# EAGLE design BASEBOARD-1-V.1.0 (EAGLE 5.06)

## Sheet 1 of 2
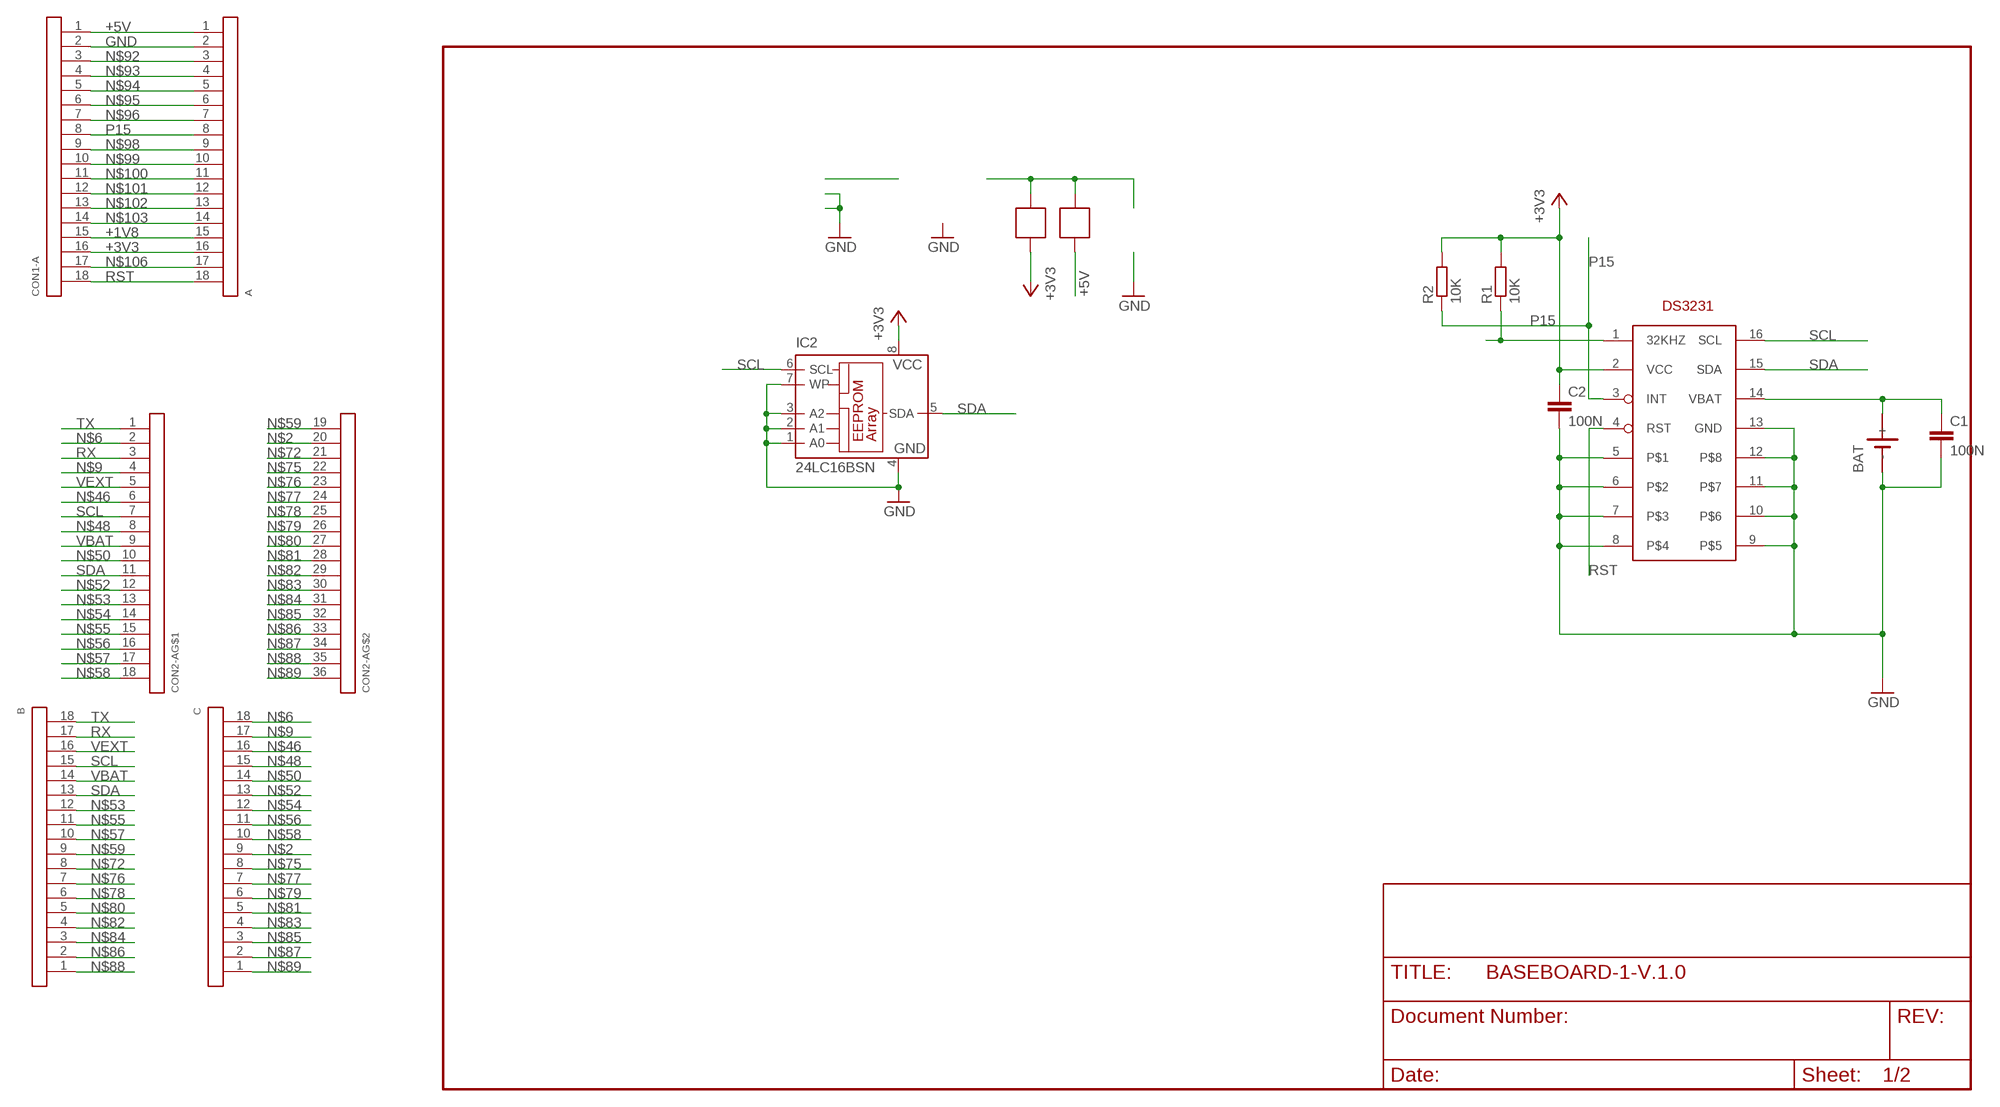
[diagram p0: schematic, sheet 1]

### Parts
A  CON18ARMCON  [CON-ARMED-18-1]
B  CON18ARMCON  [CON-ARMED-18-1]
BAT  SN2032  [SN2032]
C  CON18ARMCON  [CON-ARMED-18-1]
C1  100N  C-EUC0805  [C0805]
C2  100N  C-EUC0805  [C0805]
CON1-A  CON18ARMCON  [CON-ARMED-18-1]
CON2-A  CON18-2  [CON-ARMED-18-2]
IC2  24LC16BSN  [SO-08]
IC4  DS3231  [SO16]
R1  10K  R-EU_M0805  [M0805]
R2  10K  R-EU_M0805  [M0805]
U$1  SOLDERJUMPER  [SOLDERJUMP1]
U$2  SOLDERJUMPER  [SOLDERJUMP1]

### Nets
32KHZ: IC4.1(32KHZ) R1.1
+1V8: A.15 CON1-A.15
+3V3: A.16 C2.1 CON1-A.16 IC2.8(VCC) IC4.2(VCC) R1.2 R2.2 U$1.1 ; also sheet 2
+5V: A.1 CON1-A.1 U$2.1
GND: A.2 BAT.- C1.2 C2.2 CON1-A.2 IC2.1(A0) IC2.2(A1) IC2.3(A2) IC2.4(GND) IC2.7(WP) IC4.5 IC4.6 IC4.7 IC4.8 IC4.9 IC4.10 IC4.11 IC4.12 IC4.13(GND) ; also sheet 2
N$2: C.9 CON2-A.20
N$3: U$1.2 U$2.2
N$6: C.18 CON2-A.2
N$9: C.17 CON2-A.4
N$46: C.16 CON2-A.6
N$48: C.15 CON2-A.8
N$50: C.14 CON2-A.10
N$52: C.13 CON2-A.12
N$53: B.12 CON2-A.13
N$54: C.12 CON2-A.14
N$55: B.11 CON2-A.15
N$56: C.11 CON2-A.16
N$57: B.10 CON2-A.17
N$58: C.10 CON2-A.18
N$59: B.9 CON2-A.19
N$72: B.8 CON2-A.21
N$75: C.8 CON2-A.22
N$76: B.7 CON2-A.23
N$77: C.7 CON2-A.24
N$78: B.6 CON2-A.25
N$79: C.6 CON2-A.26
N$80: B.5 CON2-A.27
N$81: C.5 CON2-A.28
N$82: B.4 CON2-A.29
N$83: C.4 CON2-A.30
N$84: B.3 CON2-A.31
N$85: C.3 CON2-A.32
N$86: B.2 CON2-A.33
N$87: C.2 CON2-A.34
N$88: B.1 CON2-A.35
N$89: C.1 CON2-A.36
N$92: A.3 CON1-A.3
N$93: A.4 CON1-A.4
N$94: A.5 CON1-A.5
N$95: A.6 CON1-A.6
N$96: A.7 CON1-A.7
N$98: A.9 CON1-A.9
N$99: A.10 CON1-A.10
N$100: A.11 CON1-A.11
N$101: A.12 CON1-A.12
N$102: A.13 CON1-A.13
N$103: A.14 CON1-A.14
N$106: A.17 CON1-A.17
P15: A.8 CON1-A.8 IC4.3(INT) R2.1
RST: A.18 CON1-A.18 IC4.4(RST)
RX: B.17 CON2-A.3 ; also sheet 2
SCL: B.15 CON2-A.7 IC2.6(SCL) IC4.16(SCL)
SDA: B.13 CON2-A.11 IC2.5(SDA) IC4.15(SDA)
TX: B.18 CON2-A.1 ; also sheet 2
VBAT: B.14 BAT.+ C1.1 CON2-A.9 IC4.14(VBAT)
VEXT: B.16 CON2-A.5

## Sheet 2 of 2
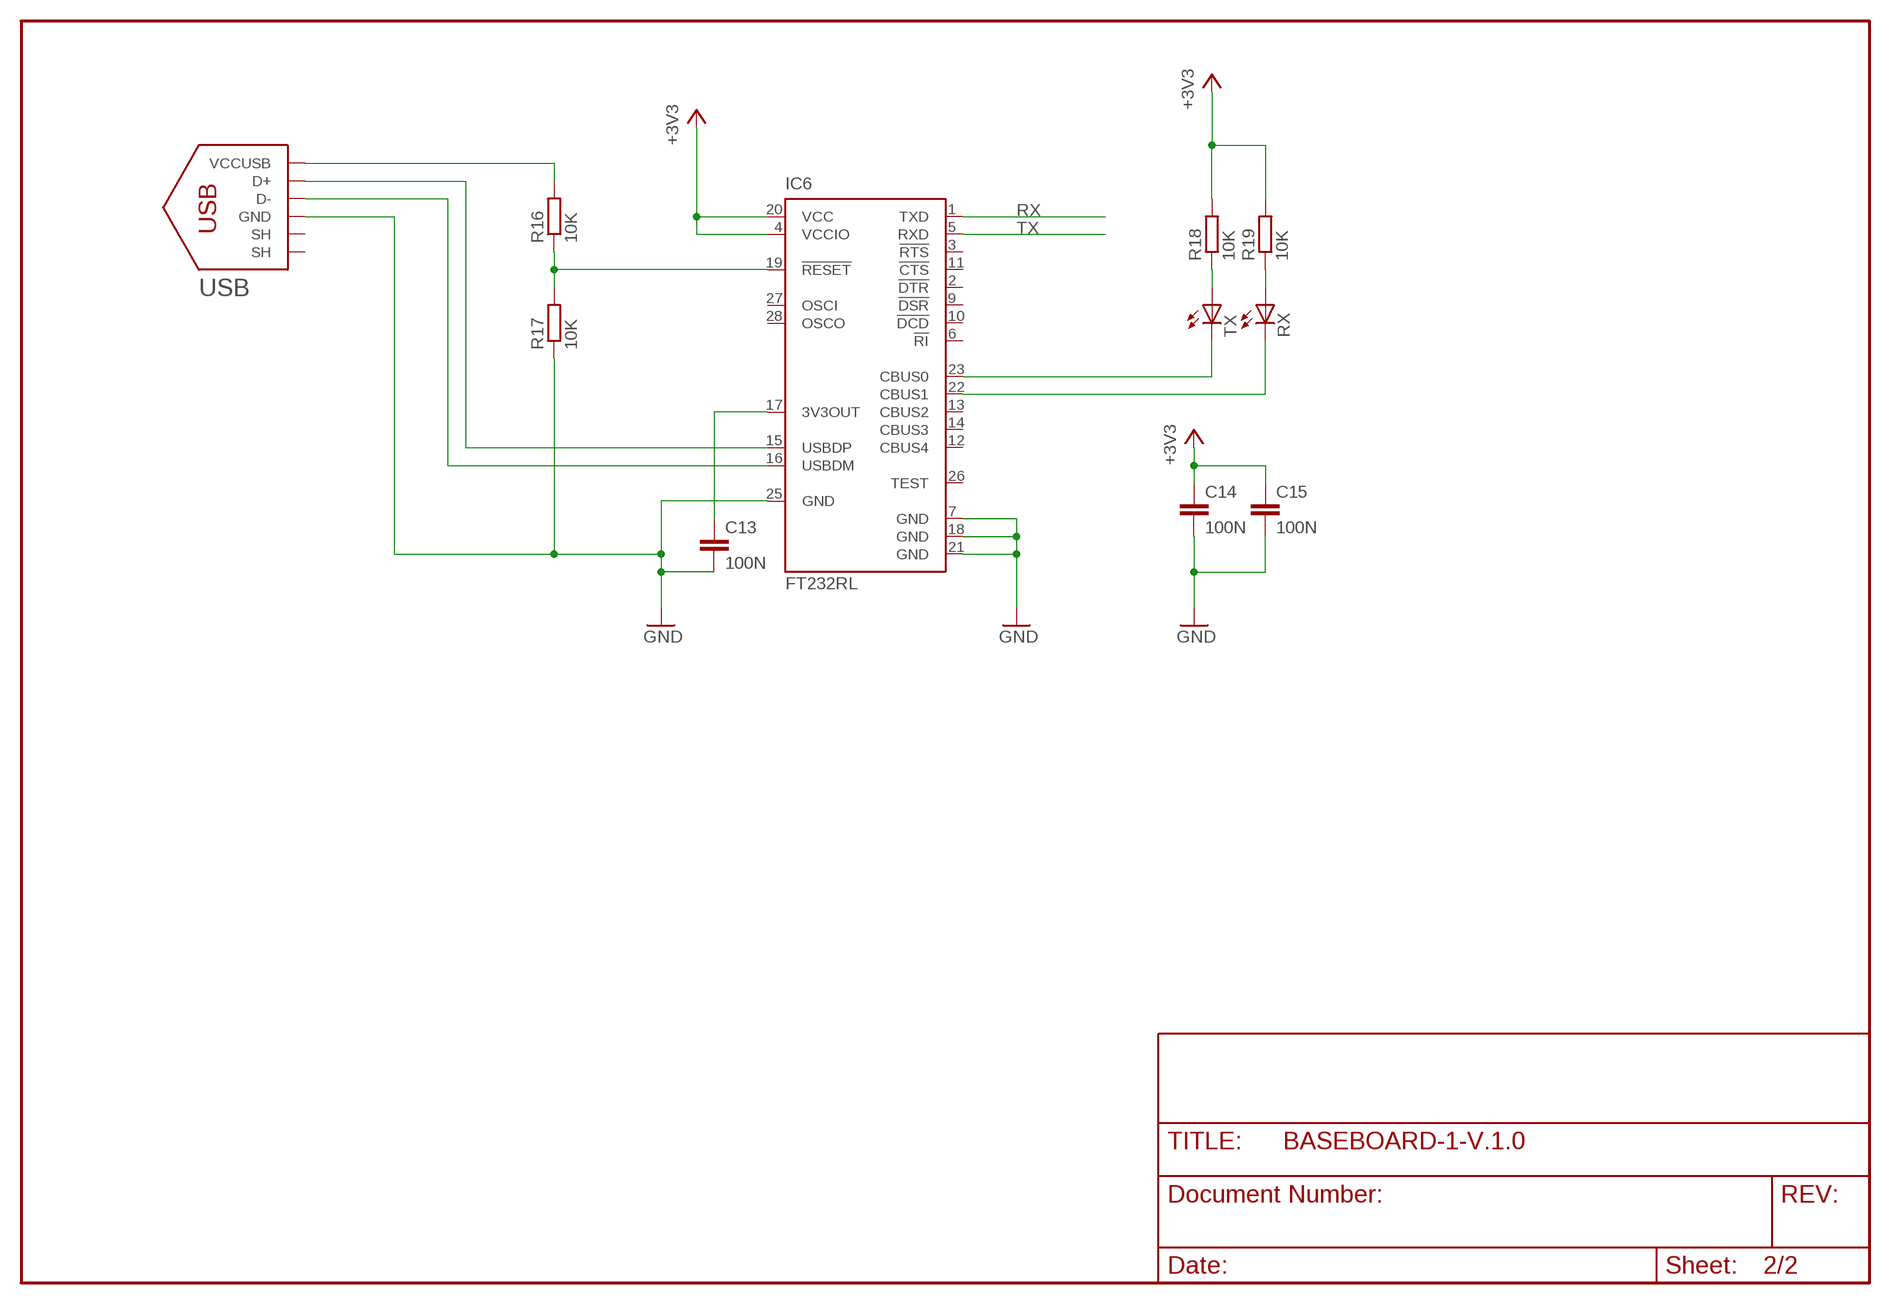
[diagram p1: schematic, sheet 2]

### Parts
C13  100N  C-EUC0805  [C0805]
C14  100N  C-EUC0805  [C0805]
C15  100N  C-EUC0805  [C0805]
IC6  FT232RL  [SSOP28]
R16  10K  R-EU_M0805  [M0805]
R17  10K  R-EU_M0805  [M0805]
R18  10K  R-EU_M0805  [M0805]
R19  10K  R-EU_M0805  [M0805]
RX  LEDCHIPLED_0805  [CHIPLED_0805]
TX  LEDCHIPLED_0805  [CHIPLED_0805]
USB  USBCONNMINI-B-HOLE  [USB-MB-H]

### Nets
+3V3: C14.1 C15.1 IC6.4(VCCIO) IC6.20(VCC) R18.2 R19.2 ; also sheet 1
GND: C13.2 C14.2 C15.2 IC6.7(GND) IC6.18(GND) IC6.21(GND) IC6.25(GND) R17.1 USB.GND ; also sheet 1
N$123: IC6.19(!RESET) R16.1 R17.2
N$124: R16.2 USB.VBUS(VCCUSB)
N$125: IC6.15(USBDP) USB.D+
N$126: IC6.16(USBDM) USB.D-
N$127: C13.1 IC6.17(3V3OUT)
N$129: IC6.23(CBUS0) TX.C
N$130: IC6.22(CBUS1) RX.C
N$132: R18.1 TX.A
N$133: R19.1 RX.A
RX: IC6.1(TXD) ; also sheet 1
TX: IC6.5(RXD) ; also sheet 1
Unconnected: IC6.2(!DTR) IC6.3(!RTS) IC6.6(!RI) IC6.9(!DSR) IC6.10(!DCD) IC6.11(!CTS) IC6.12(CBUS4) IC6.13(CBUS2) IC6.14(CBUS3) IC6.26(TEST) IC6.27(OSCI) IC6.28(OSCO) USB.GND@1(SH) USB.GND@2(SH)

## Library data of the parts
A B C CON1-A = turbod3:CON18
BAT = turbod3:SN2032: LI BATTERY
C1 C2 C13-C15 = turbod3:C-EU: CAPACITOR, European symbol
CON2-A = turbod3:CON18-2
IC2 = microchip-5:24*: Serial EEPROM I2C
IC4 = DS3231:DS3231
IC6 = ftdichip:FT232R: Source: http://www.ftdichip.com/Documents/DataSheets/DS_FT232R_v104.pdf
R1 R2 R16-R19 = turbod3:R-EU_: RESISTOR, European symbol
RX TX = turbod3:LED: LED OSRAM: - CHIPLED LG R971, LG N971, LY N971, LG Q971, LY Q971, LO R971, LY R971 LH N974, LH R974 LS Q976, LO Q976, LY Q976 LO Q996 - Hyper CHIPLED LW Q18S LB Q993, LB Q99A, LB R99A - SideLED LS A670, LO A670, LY A670, LG A670, LP A670 LB A673, LV A673, LT A673, LW A673 LH A674 LY A675 LS A676, LA A676, LO A676, LY A676, LW A676 LS A679, LY A679, LG A679 - Hyper Micro SIDELED® LS Y876, LA Y876, LO Y876, LY Y876 LT Y87S - SmartLED LW L88C, LW L88S LB L89C, LB L89S, LG L890 LS L89K, LO L89K, LY L89K LS L896, LA L896, LO L896, LY L896 - TOPLED LS T670, LO T670, LY T670, LG T670, LP T670 LSG T670, LSP T670, LSY T670, LOP T670, LYG T670 LG T671, LOG T671, LSG T671 LB T673, LV T673, LT T673, LW T673 LH T674 LS T676, LA T676, LO T676, LY T676, LB T676, LH T676, LSB T676, LW T676 LB T67C, LV T67C, LT T67C, LS T67K, LO T67K, LY T67K, LW E67C LS E67B, LA E67B, LO E67B, LY E67B, LB E67C, LV E67C, LT E67C LW T67C LS T679, LY T679, LG T679 LS T770, LO T770, LY T770, LG T770, LP T770 LB T773, LV T773, LT T773, LW T773 LH T774 LS E675, LA E675, LY E675, LS T675 LS T776, LA T776, LO T776, LY T776, LB T776 LHGB T686 LT T68C, LB T68C - Hyper Mini TOPLED® LB M676 - Mini TOPLED Santana® LG M470 LS M47K, LO M47K, LY M47K Source: http://www.osram.convergy.de LUXEON: - LUMILED® LXK2-PW12-R00, LXK2-PW12-S00, LXK2-PW14-U00, LXK2-PW14-V00 LXK2-PM12-R00, LXK2-PM12-S00, LXK2-PM14-U00 LXK2-PE12-Q00, LXK2-PE12-R00, LXK2-PE12-S00, LXK2-PE14-T00, LXK2-PE14-U00 LXK2-PB12-K00, LXK2-PB12-L00, LXK2-PB12-M00, LXK2-PB14-N00, LXK2-PB14-P00, LXK2-PB14-Q00 LXK2-PR12-L00, LXK2-PR12-M00, LXK2-PR14-Q00, LXK2-PR14-R00 LXK2-PD12-Q00, LXK2-PD12-R00, LXK2-PD12-S00 LXK2-PH12-R00, LXK2-PH12-S00 LXK2-PL12-P00, LXK2-PL12-Q00, LXK2-PL12-R00 Source: www.luxeon.com KINGBRIGHT: KA-3528ASYC Source: www.kingbright.com
U$1 U$2 = turbod3:SOLDERJUMPER
USB = turbod3:USBCONN

## Board
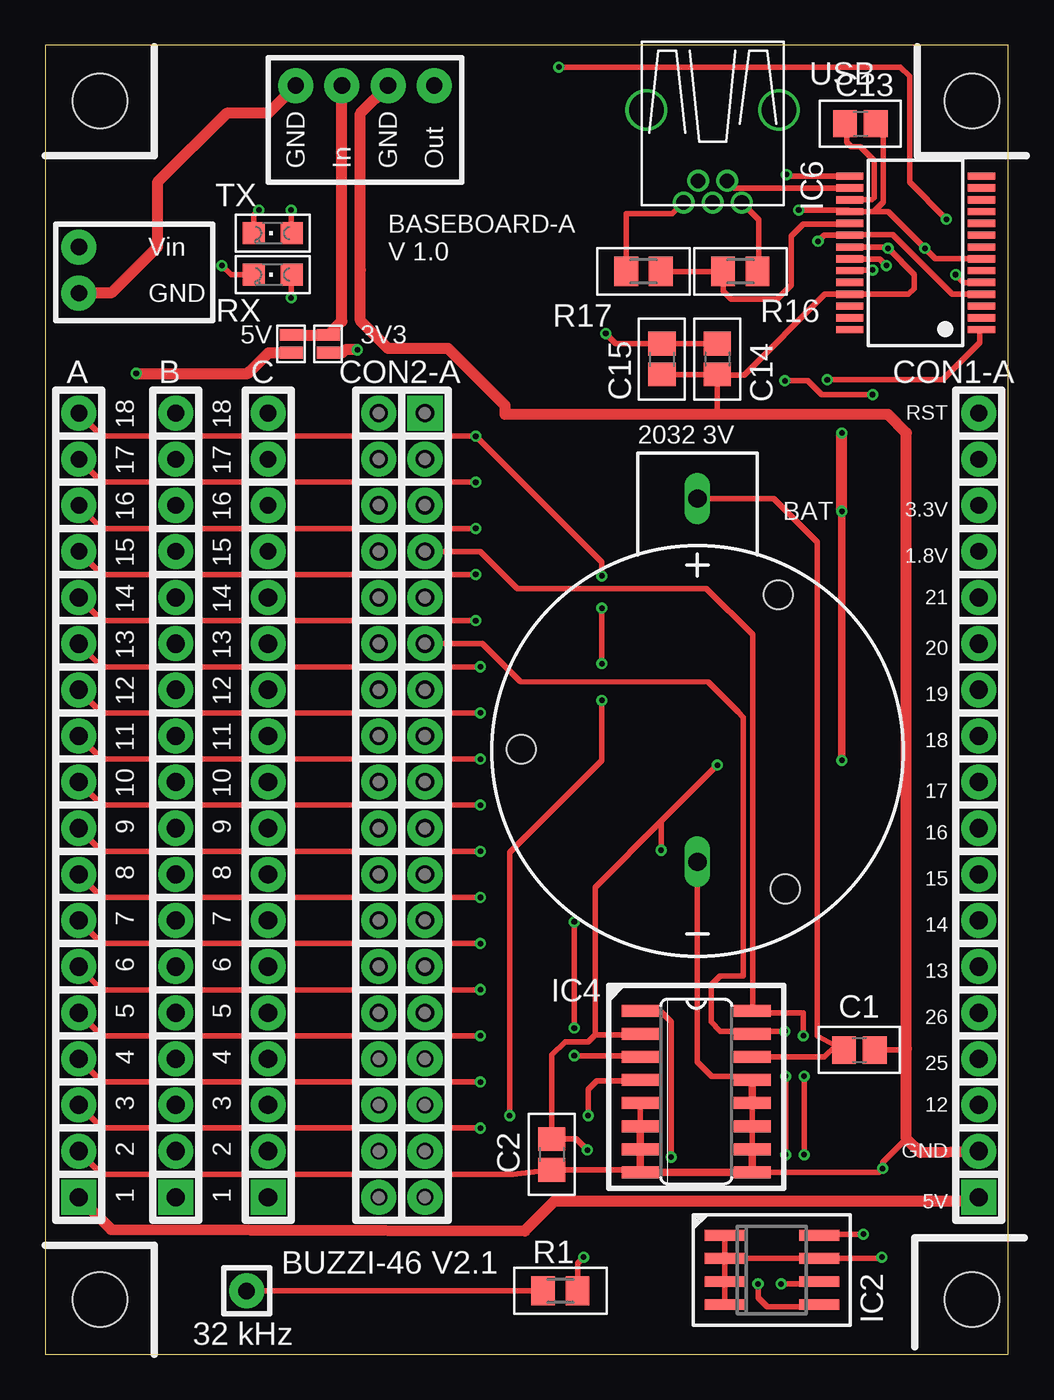
[diagram p2: board, top side]
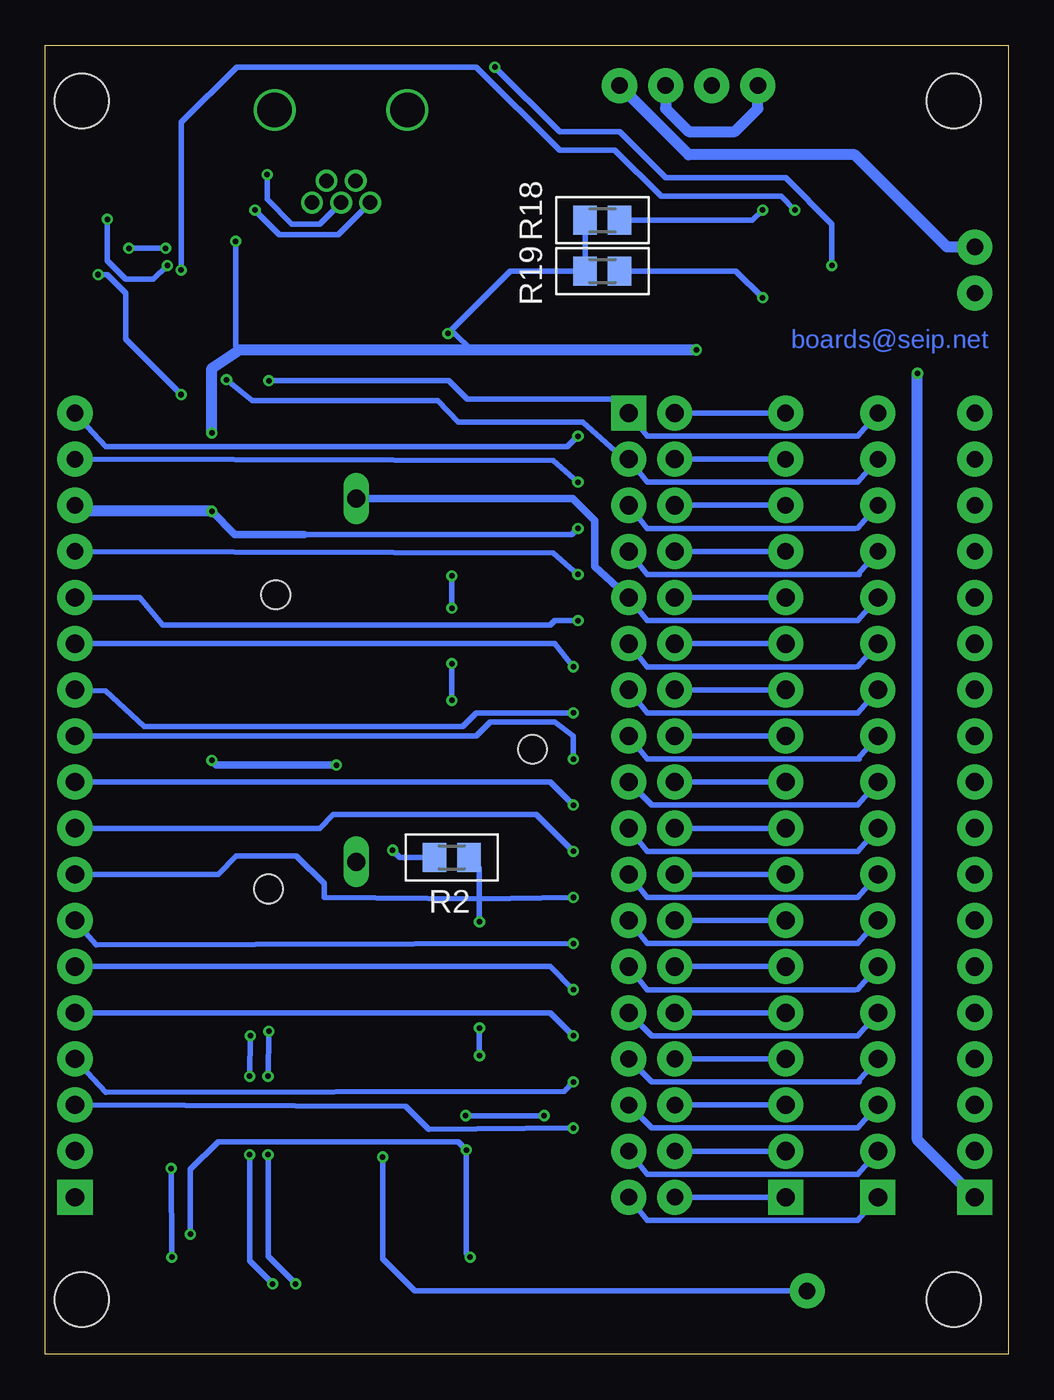
[diagram p3: board, bottom side, seen from below]

Size 53 x 72.06 mm. Coordinates in mm from the lower left corner, seen from the top.
Outline: 0,72.06 0,0 53,0 53,72.06 0,72.06
Copper layers (1*16): Top 0.035mm / dielectric 1.5mm / Bottom 0.035mm
Design rules "PCB-POOL": minimum track width 6mil, minimum drill 12mil, track to track 6mil, track to pad 6mil, pad to pad 6mil, via to via 6mil, smd to smd 6mil, copper to edge 20mil, drill to drill 8mil, minimum pad ring 8mil, minimum via ring 6mil, stop-mask expansion 3mil, vias tented up to drill 0mil, thermal gap 8mil
Holes 3 mm at 51,69 51,3 3,3 3,69

### Footprints (pad centres in the part's own frame; a part is rotated, then mirrored left to right if it is on the bottom)
CON-ARMED-18-1 = drill 1 pad 1.93 square: 1 -21.59,0 | drill 1 pad 1.93 round: 2 -19.05,0; 3 -16.51,0; 4 -13.97,0; 5 -11.43,0; 6 -8.89,0; 7 -6.35,0; 8 -3.81,0; 9 -1.27,0; 10 1.27,0; 11 3.81,0; 12 6.35,0; 13 8.89,0; 14 11.43,0 | drill 0.914 pad 1.93 round: 15 13.97,0; 16 16.51,0; 17 19.05,0; 18 21.59,0
SN2032 = drill 1 long: + 0,13.9; - 0,-6.1 | hole 1.6: 4.44,8.6; -9.7,0.1; 4.83,-7.6
C0805 = smd 1.3 x 1.5: 1 -0.85,0; 2 0.85,0
CON-ARMED-18-2 = drill 1 pad 1.93 square: 1 -21.59,1.27 | drill 1 pad 1.93 round: 2 -21.59,-1.27; 3 -19.05,1.27; 4 -19.05,-1.27; 5 -16.51,1.27; 6 -16.51,-1.27; 7 -13.97,1.27; 8 -13.97,-1.27; 9 -11.43,1.27; 10 -11.43,-1.27; 11 -8.89,1.27; 12 -8.89,-1.27; 13 -6.35,1.27; 14 -6.35,-1.27; 15 -3.81,1.27; 16 -3.81,-1.27; 17 -1.27,1.27; 18 -1.27,-1.27; 19 1.27,1.27; 20 1.27,-1.27; 21 3.81,1.27; 22 3.81,-1.27; 23 6.35,1.27; 24 6.35,-1.27; 25 8.89,1.27; 26 8.89,-1.27; 27 11.43,1.27; 28 11.43,-1.27 | drill 0.914 pad 1.93 round: 29 13.97,1.27; 30 13.97,-1.27; 31 16.51,1.27; 32 16.51,-1.27; 33 19.05,1.27; 34 19.05,-1.27; 35 21.59,1.27; 36 21.59,-1.27
SO-08 = smd 0.6 x 2.2: 1 -1.905,-2.6; 2 -0.635,-2.6; 3 0.635,-2.6; 4 1.905,-2.6; 5 1.905,2.6; 6 0.635,2.6; 7 -0.635,2.6; 8 -1.905,2.6
SO16 = smd 0.66 x 2.032: 1 -4.445,-3.073; 2 -3.175,-3.073; 3 -1.905,-3.073; 4 -0.635,-3.073; 5 0.635,-3.073; 6 1.905,-3.073; 7 3.175,-3.073; 8 4.445,-3.073; 9 4.445,3.073; 10 3.175,3.073; 11 1.905,3.073; 12 0.635,3.073; 13 -0.635,3.073; 14 -1.905,3.073; 15 -3.175,3.073; 16 -4.445,3.073
SSOP28 = smd 0.4 x 1.5: 1 -4.225,-3.625; 2 -3.575,-3.625; 3 -2.925,-3.625; 4 -2.275,-3.625; 5 -1.625,-3.625; 6 -0.975,-3.625; 7 -0.325,-3.625; 8 0.325,-3.625; 9 0.975,-3.625; 10 1.625,-3.625; 11 2.275,-3.625; 12 2.925,-3.625; 13 3.575,-3.625; 14 4.225,-3.625; 15 4.225,3.625; 16 3.575,3.625; 17 2.925,3.625; 18 2.275,3.625; 19 1.625,3.625; 20 0.975,3.625; 21 0.325,3.625; 22 -0.325,3.625; 23 -0.975,3.625; 24 -1.625,3.625; 25 -2.275,3.625; 26 -2.925,3.625; 27 -3.575,3.625; 28 -4.225,3.625
M0805 = smd 1.3 x 1.6: 1 -0.95,0; 2 0.95,0
CHIPLED_0805 = smd 1.2 x 1.2: A 0,-1.05; C 0,1.05
SOLDERJUMP1 = smd 1.27 x 0.635: 1 0,0.483; 2 0,-0.483
USB-MB-H = drill 0.8 round: D+ 5.1,0; D- 3.9,0.8; GND 5.1,-1.6; ID 3.9,-0.8; VBUS 5.1,1.6 | drill 1.9 round: GND@1 0,3.65; GND@2 0,-3.65

### Placement (x,y rotation side)
A  1.84,30.23 90 top
B  7.18,30.23 90 top
BAT  35.89,33.21 0 top
C  12.26,30.23 90 top
C1  44.8,16.74 0 top
C2  27.87,11 270 top
C13  44.86,67.74 0 top
C14  36.98,54.79 270 top
C15  33.93,54.79 270 top
CON1-A  51.37,30.23 90 top
CON2-A  19.62,30.23 270 top
IC2  39.99,4.63 270 top
IC4  35.82,14.46 270 top
IC6  47.9,60.63 90 top
R1  28.35,3.48 0 top
R2  30.63,27.36 180 bottom
R16  38.25,59.61 0 top
R17  32.92,59.61 0 top
R18  22.34,62.43 180 bottom
R19  22.34,59.63 180 bottom
RX  12.51,59.44 90 top
TX  12.51,61.72 90 top
U$1  15.56,55.63 180 top
U$2  13.53,55.63 180 top
USB  36.73,68.5 270 top

### Tracks (layer width: path | path; a pad name or v marks a point on that pad's centre or on a via)
32KHZ  (via drill 0.3 pad 0.61, 0.9 pad 1.93)
  Top 0.305: v11.07,3.48 R1.1 | v34.44,10.85 34.44,18.3 33.89,18.86 32.8,18.86 IC4.1
  Bottom 0.305: v34.44,10.85 34.44,5.26 32.66,3.48 v11.07,3.48
+1V8  (via drill 0.3)
  Top 0.305: v23.69,42.93 3.11,42.93 A.15
  Bottom 0.305: CON1-A.15 25.04,44.12 v23.69,42.93
+3V3  (via drill 0.3, 0.3 pad 0.25, 0.3 pad 0.61)
  Top 0.305: v23.69,45.47 3.11,45.47 A.16 | 30.25,17.58 29.87,17.2 28.6,17.2 27.87,16.47 C2.1 29.22,11.85 v29.83,11.24 | 33.98,29.43 30.25,25.7 30.25,17.58 | 33.98,29.43 v36.98,32.44 | IC6.4 49.92,58.35 46.63,61.65 44.32,61.65 IC6.20 42.86,61.6 v42.53,61.27 | 30.25,17.58 32.69,17.58 IC4.2 | v33.89,27.75 33.89,29.34 33.98,29.43 | v30.84,56.19 31.4,55.64 C15.1 C14.1 | v29.62,5.33 29.3,5.01 R1.2 | v45.02,6.6 42.65,6.6 IC2.8
  Top 0.406: v43.84,32.69 v43.84,46.41
  Top 0.61: v43.84,46.41 v43.84,50.72 | v17.17,55.3 16.5,55.3 16.32,55.12 15.58,55.12 U$1.1
  Bottom 0.305: 38.76,45.14 24.03,45.14 v23.69,45.47 | v45.02,6.6 45.02,10.16 43.5,11.68 30.29,11.68 v29.83,11.24 29.83,5.54 v29.62,5.33 | R2.2 33.5,27.36 v33.89,27.75 | v42.53,61.27 42.53,55.51 42.32,55.3 | 29.57,55.3 30.47,56.19 v30.84,56.19 27.96,59.08 27.4,59.63 R19.2 R18.2
  Bottom 0.406: v36.98,32.44 43.59,32.44 v43.84,32.69 | 38.76,45.14 42.57,45.14 v43.84,46.41
  Bottom 0.61: v43.84,46.41 51.21,46.41 CON1-A.16 | v17.17,55.3 22.97,55.3 29.57,55.3 42.32,55.3 43.84,54.28 v43.84,50.72
+5V  (via drill 0.3)
  Top 0.61: A.1 3.62,6.86 26.39,6.78 28.05,8.44 51.34,8.44 CON1-A.1 | U$2.1 12.28,55.14 11.24,54.1 11.14,54 v5,54
  Bottom 0.61: v5,54 5,11.79 A.1
GND  (via drill 0.3, 0.9 pad 1.93)
  Top 0.305: A.2 3.11,9.91 25.72,9.91 C2.2 32.62,10.15 IC4.8 | IC2.4 IC2.3 IC2.2 | IC2.2 IC2.1 | IC2.2 IC2.7 45.97,5.27 v46.04,5.33 | IC6.7 48.99,60.3 v48.41,60.88 46.39,62.91 IC6.18 | v46.38,60.88 46.31,60.95 IC6.21 | IC6.18 45.61,62.91 46.13,63.42 46.13,67.32 C13.2 | R17.1 31.97,62.78 34.51,62.78 USB.GND | IC6.18 44.27,62.92 | IC4.6 IC4.5 | BAT.- 35.89,16.09 36.68,15.3 38.69,15.3 IC4.13 | IC4.12 IC4.11 IC4.10 | C1.2 47.31,16.74 47.4,16.82 | 47.4,11.86 46.08,10.55 v46.08,10.22 45.88,10.01 IC4.9 | C14.2 36.98,51.78 36.94,51.74 | C14.2 C15.2 | C14.2 37.01,53.91 38.46,53.91 42.91,58.35 IC6.25 47.5,58.35 47.82,58.67 47.82,59.45 v46.38,60.88 | v46.38,60.88 v46.38,60.87 | v41.47,62.99 44.19,62.99 IC6.18
  Top 0.406: IC4.6 IC4.7 IC4.8 IC4.9 IC4.10 | IC4.12 IC4.13
  Top 0.61: CON1-A.2 48.16,11.1 47.4,11.86 47.4,16.82 47.4,50.72 46.38,51.74 36.94,51.74 25.3,51.74 25.3,52.24 22.16,55.37 18.86,55.37 17.34,56.9 17.34,59.69 17.34,68.33 v18.86,69.85 | v1.84,58.42 3.62,58.42 6.16,60.96 6.16,64.52 9.97,68.33 12.26,68.33 v13.78,69.85
  Bottom 0.305: v46.38,60.88 v48.41,60.88 | v46.08,10.22 v46.04,5.33 | USB.GND 36.89,61.65 38.25,61.65 40.12,61.65 v41.47,62.99
  Bottom 0.61: v13.78,69.85 13.78,68.58 15.05,67.31 17.59,67.31 18.86,68.58 v18.86,69.85
N$2
  Bottom 0.305: CON2-A.20 12.51,28.96 C.9
N$3  (via drill 0.9 pad 1.93)
  Top 0.61: U$2.2 U$1.2 16.32,56.87 v16.32,69.85
N$6
  Bottom 0.305: C.18 CON2-A.2
N$9
  Bottom 0.305: CON2-A.4 12.51,49.28 C.17
N$46
  Bottom 0.305: CON2-A.6 12.51,46.74 C.16
N$48
  Bottom 0.305: C.15 CON2-A.8
N$50
  Bottom 0.305: C.14 CON2-A.10
N$52
  Bottom 0.305: CON2-A.12 12.51,39.12 C.13
N$53
  Bottom 0.305: CON2-A.13 19.88,35.31 8.45,35.31 8.28,35.31 B.12
N$54
  Bottom 0.305: CON2-A.14 12.51,36.58 C.12
N$55
  Bottom 0.305: CON2-A.15 19.88,32.77 8.19,32.77 8.28,32.77 B.11
N$56
  Bottom 0.305: C.11 CON2-A.16
N$57
  Bottom 0.305: CON2-A.17 19.62,30.23 8.45,30.23 8.28,30.23 B.10
N$58
  Bottom 0.305: C.10 CON2-A.18
N$59
  Bottom 0.305: CON2-A.19 19.88,27.69 8.45,27.69 8.28,27.69 B.9
N$72
  Bottom 0.305: CON2-A.21 19.88,25.15 8.45,25.15 8.28,25.15 B.8
N$75
  Bottom 0.305: C.8 CON2-A.22
N$76
  Bottom 0.305: CON2-A.23 19.88,22.61 8.45,22.61 8.28,22.61 B.7
N$77
  Bottom 0.305: C.7 CON2-A.24
N$78
  Bottom 0.305: CON2-A.25 19.88,20.07 8.45,20.07 8.28,20.07 B.6
N$79
  Bottom 0.305: C.6 CON2-A.26
N$80
  Bottom 0.305: CON2-A.27 19.62,17.53 8.45,17.53 8.28,17.53 B.5
N$81
  Bottom 0.305: C.5 CON2-A.28
N$82
  Bottom 0.305: CON2-A.29 19.62,14.99 8.19,14.99 8.28,14.99 B.4
N$83
  Bottom 0.305: CON2-A.30 12.51,16.26 C.4
N$84
  Bottom 0.305: CON2-A.31 19.62,12.45 8.45,12.45 8.28,12.45 B.3
N$85
  Bottom 0.305: C.3 CON2-A.32
N$86
  Bottom 0.305: CON2-A.33 19.88,9.91 8.45,9.91 8.28,9.91 B.2
N$87
  Bottom 0.305: CON2-A.34 12.51,11.18 C.2
N$88
  Bottom 0.305: CON2-A.35 19.88,7.37 8.45,7.37 8.28,7.37 B.1
N$89
  Bottom 0.305: CON2-A.36 12.76,8.64 C.1
N$92  (via drill 0.3)
  Top 0.305: v23.94,12.45 3.11,12.45 A.3
  Bottom 0.305: CON1-A.3 33.17,13.64 31.9,12.37 v23.94,12.45
N$93  (via drill 0.3)
  Top 0.305: v23.94,14.99 3.11,14.99 A.4
  Bottom 0.305: CON1-A.4 49.68,14.4 24.45,14.48 v23.94,14.99
N$94  (via drill 0.3)
  Top 0.305: v23.94,17.53 3.11,17.53 A.5
  Bottom 0.305: CON1-A.5 25.21,18.8 v23.94,17.53
N$95  (via drill 0.3)
  Top 0.305: v23.94,20.07 3.11,20.07 A.6
  Bottom 0.305: CON1-A.6 25.21,21.34 v23.94,20.07
N$96  (via drill 0.3)
  Top 0.305: v23.94,22.61 3.11,22.61 A.7
  Bottom 0.305: CON1-A.7 50.19,22.53 v23.94,22.61
N$98  (via drill 0.3)
  Top 0.305: v23.94,27.69 3.11,27.69 A.9
  Bottom 0.305: CON1-A.9 37.91,28.96 37.15,29.72 25.97,29.72 v23.94,27.69
N$99  (via drill 0.3)
  Top 0.305: v23.94,30.23 3.11,30.23 A.10
  Bottom 0.305: CON1-A.10 25.21,31.5 v23.94,30.23
N$100  (via drill 0.3)
  Top 0.305: v23.94,32.77 3.11,32.77 A.11
  Bottom 0.305: CON1-A.11 29.27,34.04 28.51,34.8 24.96,34.8 23.94,34.04 v23.94,32.77
N$101  (via drill 0.3)
  Top 0.305: v23.94,35.31 3.11,35.31 A.12
  Bottom 0.305: CON1-A.12 49.68,36.5 47.56,34.54 30.04,34.54 29.27,35.31 v23.94,35.31
N$102  (via drill 0.3)
  Top 0.305: v23.94,37.85 3.11,37.85 A.13
  Bottom 0.305: CON1-A.13 24.96,39.12 v23.94,37.85
N$103  (via drill 0.3)
  Top 0.305: v23.69,40.39 3.11,40.39 A.14
  Bottom 0.305: CON1-A.14 47.82,41.66 46.55,40.13 25.21,40.13 24.96,40.39 v23.69,40.39
N$106  (via drill 0.3)
  Top 0.305: v23.69,48.01 3.11,48.01 A.17
  Bottom 0.305: CON1-A.17 25.04,49.2 v23.69,48.01
N$123
  Top 0.305: R17.2 R16.1 37.3,58.53 37.74,58.09 40.28,58.09 41.05,58.85 41.05,61.56 41.72,62.23 44.25,62.23 IC6.19
N$124
  Top 0.305: R16.2 39.27,59.68 39.27,61.9 39.27,62.46 USB.VBUS
N$125  (via drill 0.3)
  Top 0.305: IC6.15 40.88,64.86 v40.79,64.95
  Bottom 0.305: v40.79,64.95 40.79,63.59 39.43,62.23 37.9,62.23 USB.D+
N$126
  Top 0.305: IC6.16 37.93,64.2 USB.D-
N$127
  Top 0.305: IC6.17 45.49,63.55 45.62,63.68 45.62,65.71 44.86,66.47 44.35,66.47 44.09,66.73 44.09,67.65 C13.1
N$129  (via drill 0.3)
  Top 0.305: v45.53,59.69 44.31,59.69 IC6.23 | TX.C 11.46,62.7 v11.75,62.99
  Bottom 0.305: v45.53,59.69 45.53,60.45 45.53,67.82 42.48,70.87 29.27,70.87 24.7,66.29 21.65,66.29 19.11,63.75 12.51,63.75 v11.75,62.99
N$130  (via drill 0.3)
  Top 0.305: 29.53,70.87 29.27,70.87 | 29.53,70.87 38.93,70.87 47.05,70.87 47.56,70.36 47.56,64.52 v49.59,62.48 | IC6.22 44.54,60.3 45.94,60.3 v46.29,59.94 | RX.C 10.22,59.44 v9.72,59.94 | v28.26,70.87 29.53,70.87
  Bottom 0.305: v49.59,62.48 49.59,60.2 48.58,59.18 47.05,59.18 v46.29,59.94 | v9.72,59.94 9.72,62.23 12.26,64.77 18.86,64.77 21.4,67.31 24.7,67.31 v28.26,70.87
N$132  (via drill 0.3)
  Top 0.305: 13.53,61.76 v13.53,62.99
  Top 0.406: TX.A 13.53,61.76
  Bottom 0.305: R18.1 14.09,62.43 v13.53,62.99
N$133  (via drill 0.3)
  Top 0.305: v13.53,58.17 13.53,59.4
  Top 0.406: 13.53,59.4 RX.A
  Bottom 0.305: R19.1 14.99,59.63 v13.53,58.17
P15  (via drill 0.3)
  Top 0.305: v23.94,25.15 3.11,25.15 A.8 | v29.11,23.8 v29.11,17.96 | v29.11,16.43 32.68,16.43 IC4.3
  Bottom 0.305: 29.11,25.07 37.66,25.15 37.66,25.91 39.18,27.43 42.49,27.43 43.5,26.42 CON1-A.8 | v23.94,25.15 29.11,25.07 | v29.11,17.96 v29.11,16.43 | 29.11,25.07 v29.11,23.8 | 29.11,25.07 29.11,26.78 R2.1
RST  (via drill 0.3, 0.3 pad 0.61)
  Top 0.305: A.18 3.11,50.55 v23.69,50.55 30.63,43.61 v30.63,42.85 | v25.55,13.13 25.55,27.61 30.63,32.69 v30.63,35.99 | v30.63,38.02 v30.63,41.07 | v29.87,13.13 29.87,14.58 30.33,15.05 32.7,15.05 IC4.4
  Bottom 0.305: v25.55,13.13 v29.87,13.13 | v30.63,35.99 v30.63,38.02 | v30.63,41.07 v30.63,42.85 | CON1-A.18 49.68,49.96 24.28,49.96 v23.69,50.55
RX  (via drill 0.3 pad 0.25)
  Top 0.305: v43.03,53.65 49.38,53.65 51.42,55.69 51.42,56.29 IC6.1
  Bottom 0.305: v43.03,53.65 41.63,52.5 31.39,52.5 30.29,51.31 23.43,51.31 21.15,49.28 CON2-A.3 19.88,48.01 8.45,48.01 8.28,48.01 B.17
SCL  (via drill 0.3)
  Top 0.305: CON2-A.7 23.94,44.2 25.97,42.16 36.39,42.16 38.93,39.62 38.93,34.8 38.93,20.32 38.93,20.07 38.93,18.93 IC4.16 39,18.8 41.72,18.8 v41.72,17.53 | v41.76,10.98 v41.76,15.3 | v40.49,3.87 42.46,3.87 IC2.6
  Bottom 0.305: CON2-A.7 19.88,42.93 8.19,42.93 8.28,42.93 B.15 | v41.76,15.3 v41.72,17.53 | v41.76,10.98 41.76,5.14 v40.49,3.87
SDA  (via drill 0.3)
  Top 0.305: CON2-A.11 24.04,39.12 26.12,37.03 36.47,37.01 38.12,35.36 | 38.12,35.36 38.42,35.05 38.42,20.83 37.15,20.83 36.64,20.32 36.64,18.29 37.15,17.78 39.18,17.78 | 38.12,35.36 38,35.48 | 39.18,17.78 IC4.15 | v40.7,17.78 39.18,17.78 | v40.75,10.98 v40.75,15.3 | v39.22,3.87 39.22,3.11 39.73,2.6 42.46,2.6 IC2.5
  Bottom 0.305: CON2-A.11 19.88,37.85 8.45,37.85 8.28,37.85 B.13 | v40.75,15.3 v40.7,17.78 | v40.75,10.98 40.75,5.39 v39.22,3.87
TX  (via drill 0.3, 0.3 pad 0.25)
  Top 0.305: v40.7,53.59 41.97,53.59 42.74,52.83 42.97,52.83 v45.53,52.83 | IC6.5 50.53,59.01 v50.1,59.44
  Bottom 0.305: v40.7,53.59 30.8,53.59 29.78,52.58 21.4,52.58 CON2-A.1 19.88,50.55 8.45,50.55 8.28,50.55 B.18 | v50.1,59.44 49.59,59.44 48.58,58.42 48.58,55.88 v45.53,52.83
VBAT
  Top 0.305: BAT.+ 40.09,47.11 42.48,44.7 42.48,17.53 43.5,16.98 | 43.5,16.98 C1.1 | IC4.14 42.88,16.36 43.5,16.98
  Bottom 0.305: CON2-A.9 19.88,40.39 8.45,40.39 8.28,40.39 B.14
  Bottom 0.406: BAT.+ 23.97,47.11 22.76,45.9 22.76,43.36 CON2-A.9
VEXT
  Bottom 0.305: CON2-A.5 19.88,45.47 8.45,45.47 8.28,45.47 B.16
VINEXT  (via drill 0.9 pad 1.93)
  Bottom 0.61: v1.84,60.96 3.37,60.96 8.45,66.04 17.59,66.04 v21.4,69.85

### Text on the board
Bottom: boards@seip.net
tNames: GND | In | GND | Out | BASEBOARD-A | Vin | V 1.0 | GND | 5V | 3V3 | 18 | 18 | RST | 17 | 17 | 2032 3V | 16 | 16 | 3.3V | 15 | 15 | 1.8V | 14 | 14 | 21 | 13 | 13 | 20 | 12 | 12 | 19 | 11 | 11 | 18 | 10 | 10 | 17 | 9 | 9 | 16 | 8 | 8 | 15 | 7 | 7 | 14 | 6 | 6 | 13 | 5 | 5 | 26 | 4 | 4 | 25 | 3 | 3 | 12 | 2 | 2 | GND | 1 | 1 | 5V | BUZZI-46 V2.1 | 32 kHz